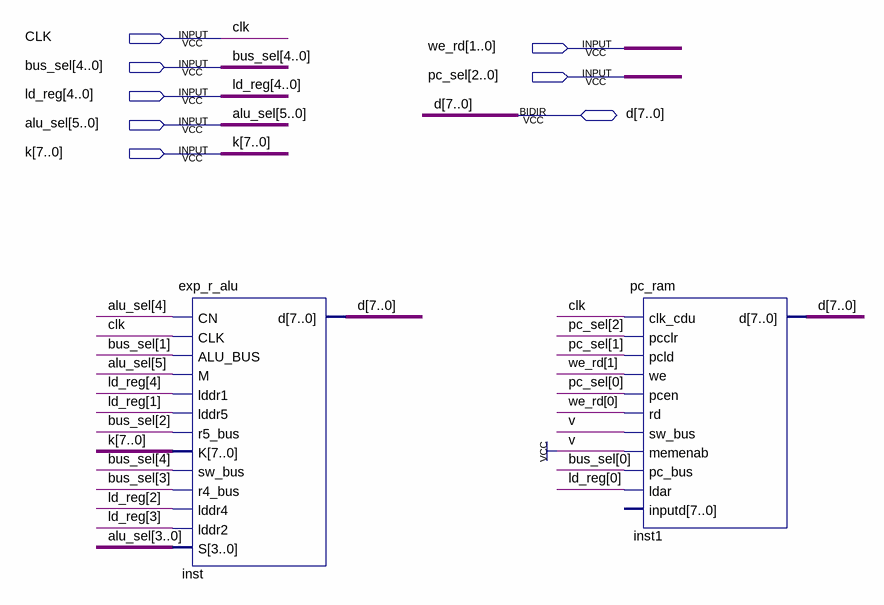
[diagram p0: schematic sheet]
// Quartus schematic data_path.bdf as structural Verilog: 2 symbols, 8 pins
module data_path (
  input  CLK,
  input  [1:0] we_rd,
  input  [4:0] bus_sel,
  input  [2:0] pc_sel,
  input  [4:0] ld_reg,
  input  [5:0] alu_sel,
  input  [7:0] k,
  inout  [7:0] d
);

  exp_r_alu inst (
    .CN(alu_sel[4]), .CLK(CLK), .ALU_BUS(bus_sel[1]), .M(alu_sel[5]), .lddr1(ld_reg[4]), .lddr5(ld_reg[1]),
    .r5_bus(bus_sel[2]), .K(k), .sw_bus(bus_sel[4]), .r4_bus(bus_sel[3]), .lddr4(ld_reg[2]),
    .lddr2(ld_reg[3]), .S(alu_sel[3:0]), .d(d));
  pc_ram inst1 (
    .clk_cdu(CLK), .pcclr(pc_sel[2]), .pcld(pc_sel[1]), .we(we_rd[1]), .pcen(pc_sel[0]), .rd(we_rd[0]),
    .sw_bus(1'b1), .memenab(1'b1), .pc_bus(bus_sel[0]), .ldar(ld_reg[0]), .d(d));  // open: inputd
endmodule
